# EAGLE design HarpTransistors_3v (EAGLE 7.5.0)
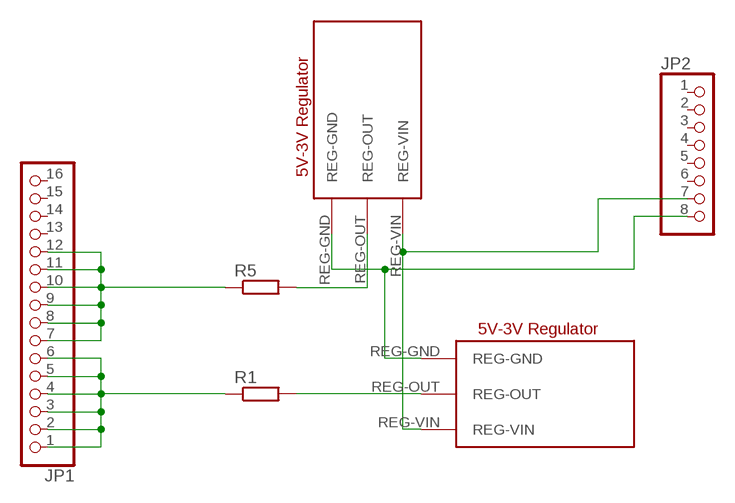
[diagram p0: schematic, sheet 1]

## Parts
JP1  PINHD-1X16  [1X16]
JP2  PINHD-1X8  [1X08]
R1  R-EU_0204/5  [0204/5]
R5  R-EU_0204/5  [0204/5]
U$1  5V-TO-3V-REG-DEV  [5V-TO-3V-REG-PAC]
U$2  5V-TO-3V-REG-DEV  [5V-TO-3V-REG-PAC]

## Nets
N$1: R5.2 U$1.REG-OUT
N$2: JP1.1 JP1.2 JP1.3 JP1.4 JP1.5 JP1.6 R1.1
N$4: R1.2 U$2.REG-OUT
N$8: JP2.8 U$1.REG-GND U$2.REG-GND
N$17: JP2.7 U$1.REG-VIN U$2.REG-VIN
N$25: JP1.7 JP1.8 JP1.9 JP1.10 JP1.11 JP1.12 R5.1
Unconnected: JP1.13 JP1.14 JP1.15 JP1.16 JP2.1 JP2.2 JP2.3 JP2.4 JP2.5 JP2.6

## Library data of the parts
JP1 = pinhead:PINHD-1X16: PIN HEADER
JP2 = pinhead:PINHD-1X8: PIN HEADER
R1 R5 = resistor:R-EU_: RESISTOR, European symbol
U$1 U$2 = Dr_Burrows_library:5V-TO-3V-REG-DEV: 5v to 3v Regulator

## Board
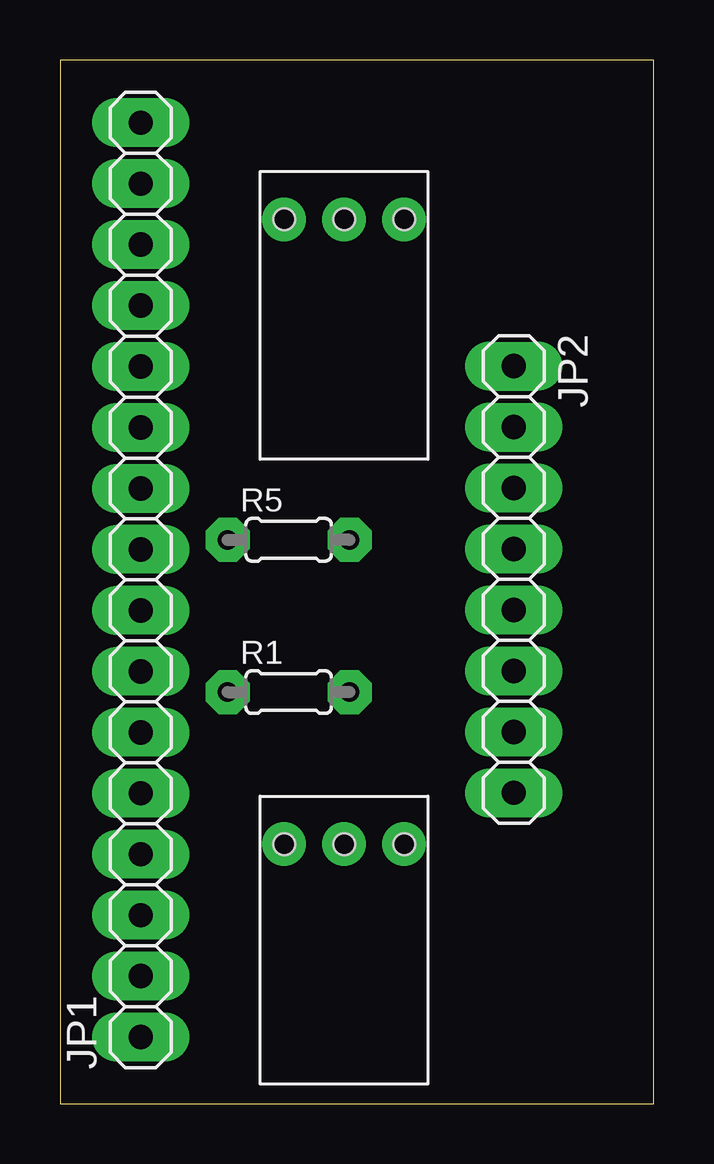
[diagram p1: board, top side]
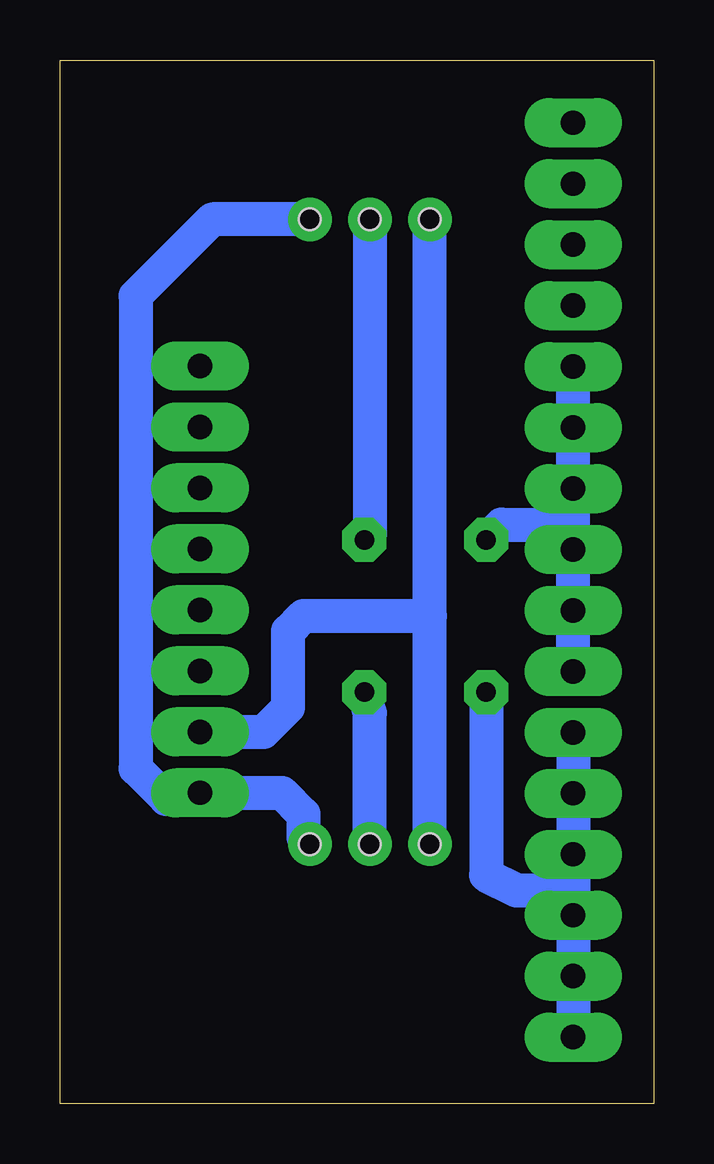
[diagram p2: board, bottom side, seen from below]

Size 24.75 x 43.48 mm. Coordinates in mm from the lower left corner, seen from the top.
Outline: 0,0 24.75,0 24.75,43.48 0,43.48 0,0
Copper layers (1*16): Top 0.035mm / dielectric 1.5mm / Bottom 0.035mm
Design rules "default *": minimum track width 10mil, minimum drill 24mil, track to track 8mil, track to pad 8mil, pad to pad 8mil, via to via 8mil, smd to smd 8mil, copper to edge 40mil, drill to drill 8mil, minimum pad ring 10mil, minimum via ring 8mil, stop-mask expansion 4mil, vias tented up to drill 0mil, thermal gap 10mil

### Footprints (pad centres in the part's own frame; a part is rotated, then mirrored left to right if it is on the bottom)
1X16 = drill 1.016 long: 1 -19.05,0; 2 -16.51,0; 3 -13.97,0; 4 -11.43,0; 5 -8.89,0; 6 -6.35,0; 7 -3.81,0; 8 -1.27,0; 9 1.27,0; 10 3.81,0; 11 6.35,0; 12 8.89,0; 13 11.43,0; 14 13.97,0; 15 16.51,0; 16 19.05,0
1X08 = drill 1.016 long: 1 -8.89,0; 2 -6.35,0; 3 -3.81,0; 4 -1.27,0; 5 1.27,0; 6 3.81,0; 7 6.35,0; 8 8.89,0
0204/5 = drill 0.813 octagon: 1 -2.54,0; 2 2.54,0
5V-TO-3V-REG-PAC = drill 0.8 pad 1.676: REG-GND 7,-1; REG-OUT 7,1.5; REG-VIN 7,4 | hole 0.9: 7,4; 7,-1; 7,1.5

### Placement (x,y rotation side)
JP1  3.36,21.82 90 top
JP2  18.91,21.84 270 top
R1  9.53,17.14 0 top
R5  9.53,23.5 0 top
U$1  13.34,29.85 90 top
U$2  13.34,3.81 90 top

### Tracks (layer width: path | path; a pad name or v marks a point on that pad's centre or on a via)
N$1
  Bottom 1.422: U$1.REG-OUT 11.84,23.72 R5.2
N$2
  Bottom 1.422: JP1.6 JP1.5 JP1.4 3.36,8.89 | 3.36,8.89 JP1.3 JP1.2 JP1.1 | R1.1 6.99,9.52 5.71,8.89 3.36,8.89
N$4
  Bottom 1.422: U$2.REG-OUT 11.84,16.28 R1.2
N$8
  Bottom 1.422: U$1.REG-GND 18.4,36.85 21.59,33.66 21.59,13.97 20.32,12.7 19.16,12.7 JP2.8 15.49,12.95 14.61,12.07 14.61,11.08 U$2.REG-GND
N$17
  Bottom 1.422: U$2.REG-VIN 9.34,20.32 | 9.34,20.32 U$1.REG-VIN | JP2.7 16.26,15.49 15.24,16.51 15.24,19.68 14.61,20.32 9.34,20.32
N$25
  Bottom 1.422: JP1.7 JP1.8 JP1.9 3.36,24.13 | 3.36,24.13 JP1.10 JP1.11 JP1.12 | R5.1 6.35,24.13 3.36,24.13